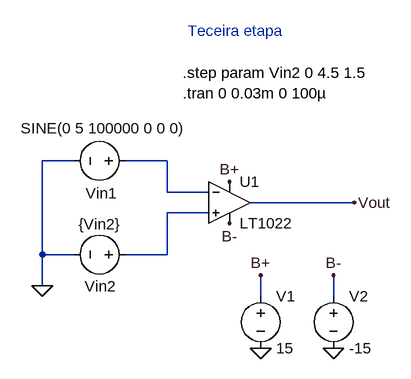
[diagram p0: schematic Lab3_3.asc]
Lab3_3.asc, the LTspice schematic file:
Version 4
SHEET 1 880 680
WIRE 208 320 160 320
WIRE 352 320 288 320
WIRE 352 368 352 320
WIRE 416 368 352 368
WIRE 640 384 480 384
WIRE 416 400 352 400
WIRE 160 464 160 320
WIRE 208 464 160 464
WIRE 352 464 352 400
WIRE 352 464 288 464
WIRE 160 512 160 464
WIRE 496 528 496 496
WIRE 608 528 608 496
FLAG 608 608 0
FLAG 496 608 0
FLAG 608 496 B-
FLAG 496 496 B+
FLAG 448 416 B-
FLAG 448 352 B+
FLAG 640 384 Vout
FLAG 160 512 0
SYMBOL opamps/LT1022 448 320 R0
SYMATTR InstName U1
SYMBOL voltage 496 512 R0
SYMATTR InstName V1
SYMATTR Value 15
SYMBOL voltage 608 512 R0
SYMATTR InstName V2
SYMATTR Value -15
SYMBOL voltage 304 320 R90
WINDOW 0 65 53 VBottom 2
WINDOW 3 -66 50 VTop 2
SYMATTR InstName Vin1
SYMATTR Value SINE(0 5 100000 0 0 0)
SYMBOL voltage 304 464 R90
WINDOW 0 64 55 VBottom 2
WINDOW 3 -62 56 VTop 2
SYMATTR InstName Vin2
SYMATTR Value {Vin2}
TEXT 376 216 Left 2 !.tran 0 0.03m 0 100µ
TEXT 384 120 Left 2 ;Teceira etapa
TEXT 376 184 Left 2 !.step param Vin2 0 4.5 1.5

The netlist it stands for:
* Lab3_3.asc
XU1 N002 N001 B+ B- Vout LT1022  ; pins In+ In- V+ V- OUT
V1 B+ 0 15
V2 B- 0 -15
Vin1 N001 0 SINE(0 5 100000 0 0 0)
Vin2 N002 0 {Vin2}
.tran 0 0.03m 0 100µ
* Teceira etapa
.step param Vin2 0 4.5 1.5
.backanno
.end